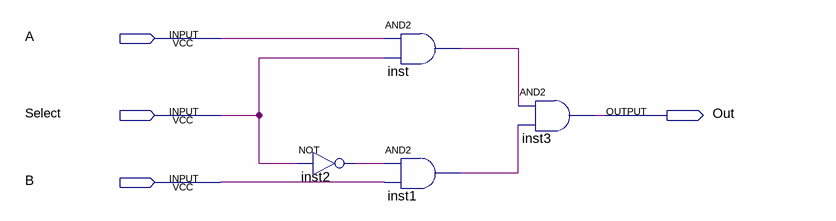
[diagram p0: schematic sheet]
// Quartus schematic 2_to_1_MUX.bdf as structural Verilog: 4 symbols, 4 pins
module \2_to_1_MUX  (
  input  A,
  input  Select,
  input  B,
  output Out
);

  wire inst1_out, inst2_out, inst_out;

  not inst2 (inst2_out, Select);
  and inst (inst_out, A, Select);
  and inst1 (inst1_out, inst2_out, B);
  and inst3 (Out, inst_out, inst1_out);
endmodule
